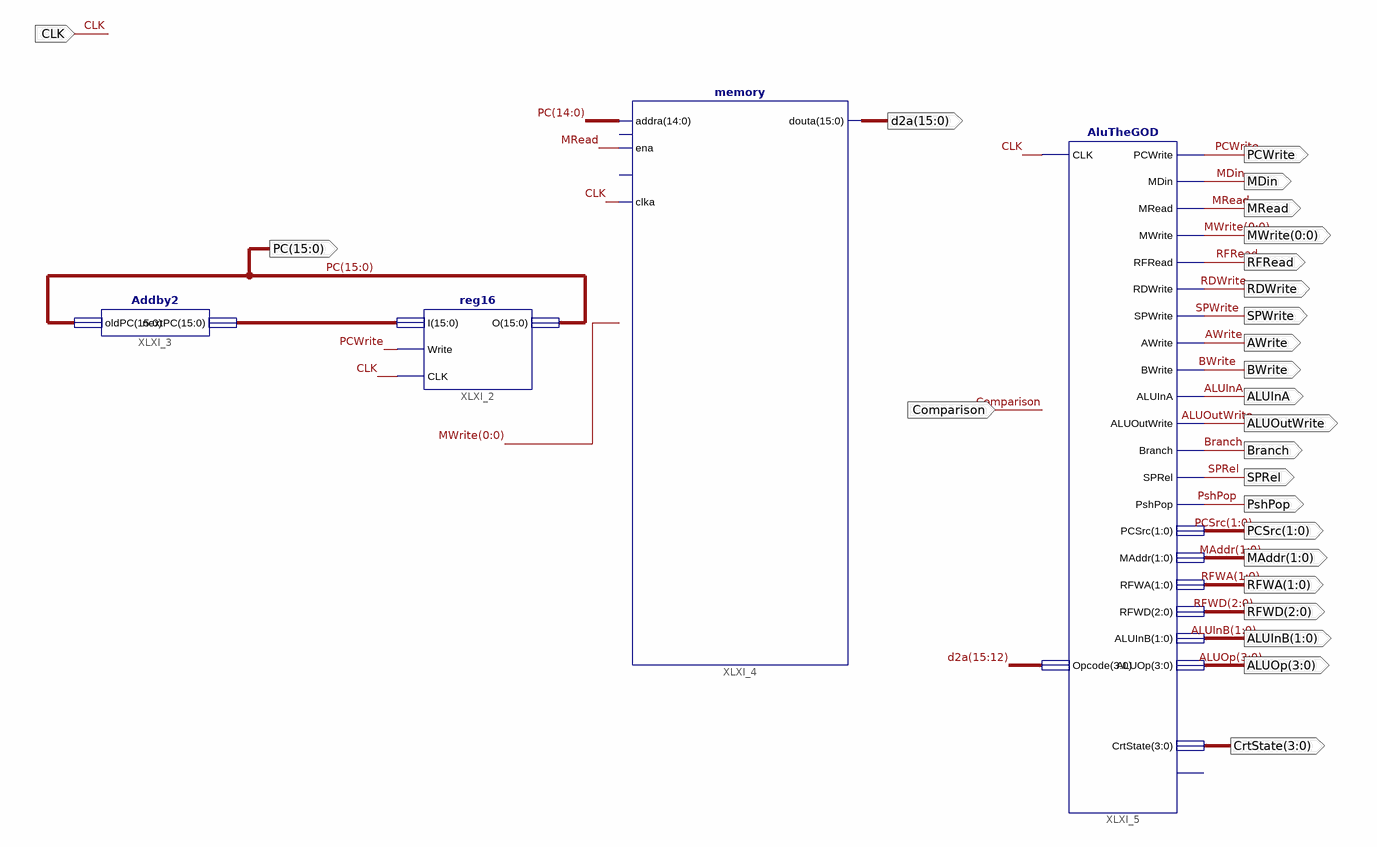
[diagram p0: schematic sheet 1]
// Xilinx ISE schematic TEST_PCMemControl.sch (spartan3e) as structural Verilog: 4 symbols, 25 ports
module TEST_PCMemControl (
  input  CLK,
  input  Comparison,
  output PCWrite,
  output MDin,
  output MRead,
  output [0:0] MWrite,
  output RFRead,
  output RDWrite,
  output SPWrite,
  output AWrite,
  output BWrite,
  output ALUInA,
  output ALUOutWrite,
  output Branch,
  output SPRel,
  output PshPop,
  output [1:0] PCSrc,
  output [1:0] MAddr,
  output [1:0] RFWA,
  output [2:0] RFWD,
  output [1:0] ALUInB,
  output [3:0] ALUOp,
  output [15:0] d2a,
  output [15:0] PC,
  output [3:0] CrtState
);

  wire [15:0] XLXN_3;

  reg16 XLXI_2 (.I(XLXN_3), .Write(PCWrite), .CLK(CLK), .O(PC));
  Addby2 XLXI_3 (.oldPC(PC), .nextPC(XLXN_3));
  memory XLXI_4 (.addra(PC[14:0]), .ena(MRead), .clka(CLK), .douta(d2a));  // open: dina, wea
  AluTheGOD XLXI_5 (
    .CLK(CLK), .Opcode(d2a[15:12]), .PCWrite(PCWrite), .MDin(MDin), .MRead(MRead), .MWrite(MWrite[0]),
    .RFRead(RFRead), .RDWrite(RDWrite), .SPWrite(SPWrite), .AWrite(AWrite), .BWrite(BWrite), .ALUInA(ALUInA),
    .ALUOutWrite(ALUOutWrite), .Branch(Branch), .SPRel(SPRel), .PshPop(PshPop), .PCSrc(PCSrc), .MAddr(MAddr),
    .RFWA(RFWA), .RFWD(RFWD), .ALUInB(ALUInB), .ALUOp(ALUOp), .CrtState(CrtState));  // open: IRWrite
endmodule
